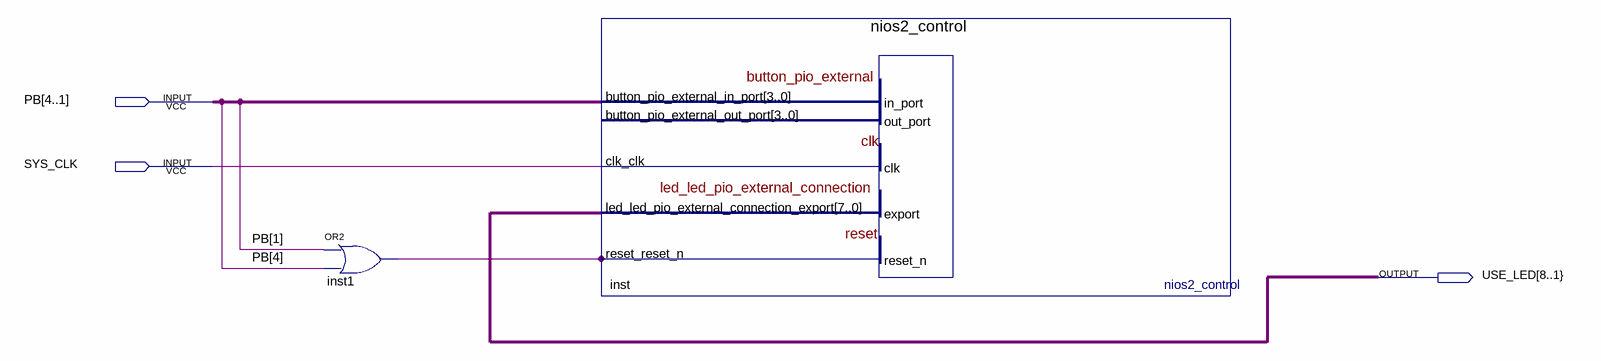
[diagram p0: schematic sheet]
// Quartus schematic BeMicro_MAX10_top.bdf as structural Verilog: 2 symbols, 3 pins
module BeMicro_MAX10_top (
  input  [4:1] PB,
  input  SYS_CLK,
  output \USE_LED[8..1} 
);

  wire inst1_out;
  wire [7:0] inst_led_led_pio_external_connection_export;

  or inst1 (inst1_out, PB[1], PB[4]);
  nios2_control inst (
    .button_pio_external_in_port(PB), .clk_clk(SYS_CLK), .reset_reset_n(inst1_out),
    .led_led_pio_external_connection_export(inst_led_led_pio_external_connection_export));  // open: button_pio_external_out_port
endmodule
